# EAGLE design billdetect_irrecv1 (EAGLE 5.11)
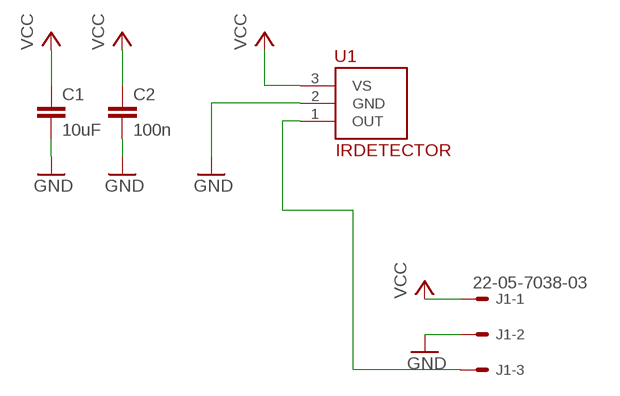
[diagram p0: schematic, sheet 1]

## Parts
C1  10uF  CAP0805  [0805]
C2  100n  CAP0805  [0805]
J1  22-05-7038-03  [7395-03]
U1  IRDETECTOR  [TSOP-3PIN-2.54MM]

## Nets
GND: C1.2 C2.2 J1.2 U1.2(GND)
N$1: J1.3 U1.1(OUT)
VCC: C1.1 C2.1 J1.1 U1.3(VS)

## Library data of the parts
C1 C2 = SparkFun-20110517:CAP: Capacitor Standard 0603 ceramic capacitor, and 0.1" leaded capacitor.
J1 = con-molex:22-?-03: CONNECTOR wire to board 2.54 mm (.1 inch) pitch header; OC_FARNELL: unknown; OC_NEWARK: unknown
U1 = todstuff:IRDETECTOR: Vishay TSOP348.., TSOP344.. IR receiver modules CARRIER FREQUENCY STD (AGC2,AGC8) NOISY ENV(AGC4) 30 kHz TSOP34830 TSOP34430 33 kHz TSOP34833 TSOP34433 36 kHz TSOP34836 TSOP34436 38 kHz TSOP34838 TSOP34438 40 kHz TSOP34840 TSOP34440 56 kHz TSOP34856 TSOP34456

## Board
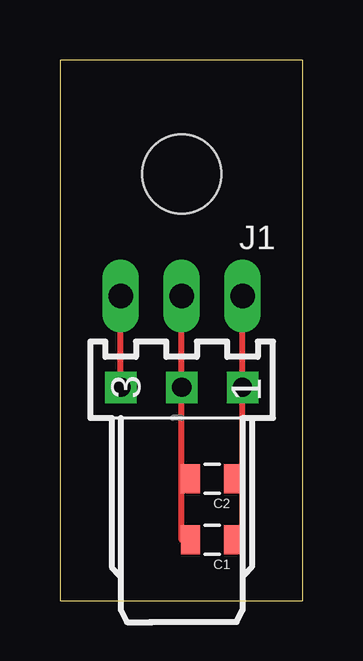
[diagram p1: board, top side]
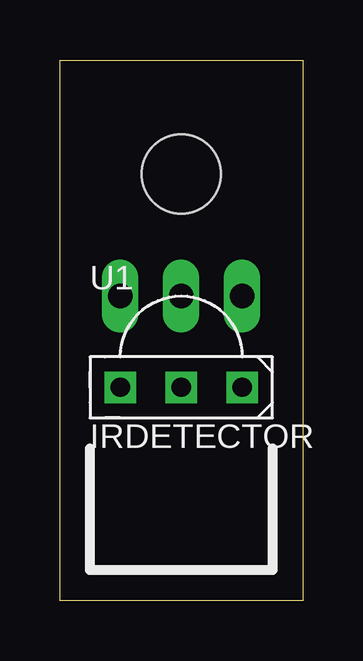
[diagram p2: board, bottom side, seen from below]

Size 10.14 x 22.53 mm. Coordinates in mm from the lower left corner, seen from the top.
Outline: 0,0 10.14,0 10.14,22.53 0,22.53 0,0
Copper layers (1*16): Top 0.035mm / dielectric 1.5mm / Bottom 0.035mm
Design rules "default": minimum track width 10mil, minimum drill 24mil, track to track 8mil, track to pad 8mil, pad to pad 8mil, via to via 8mil, smd to smd 8mil, copper to edge 40mil, drill to drill 8mil, minimum pad ring 10mil, minimum via ring 8mil, stop-mask expansion 4mil, vias tented up to drill 0mil, thermal gap 10mil

### Footprints (pad centres in the part's own frame; a part is rotated, then mirrored left to right if it is on the bottom)
0805 = smd 0.8 x 1.2: 1 -0.9,0; 2 0.9,0
7395-03 = drill 1.016 long: 1 2.54,0; 2 0,0; 3 -2.54,0
TSOP-3PIN-2.54MM = drill 0.8 square: 1 5.08,0; 2 2.54,0; 3 0,0
STAND-OFF = hole 3.302: 0,0

### Placement (x,y rotation side)
C1  6.35,2.54 180 top
C2  6.35,5.08 180 top
J1  5.08,12.7 0 top
U1  7.62,8.89 0 bottom
U$1  [STAND-OFF]  5.08,17.78 0 top

### Tracks (layer width: path | path; a pad name or v marks a point on that pad's centre or on a via)
GND
  Top 0.254: 5.08,5.08 5.08,2.54 C1.2 | 5.08,5.08 C2.2 5.08,5.08 | 5.08,5.08 U1.2 J1.2
N$1
  Top 0.254: U1.1 J1.3
VCC
  Top 0.254: 7.62,5.08 7.62,2.54 C1.1 | 7.62,5.08 C2.1 7.62,5.08 | 7.62,5.08 U1.3 J1.1